# Altium schematic sheet bOOST cONVERTER_var 2.SchDoc
size A; SheetNumber: 3; SheetTotal: 4
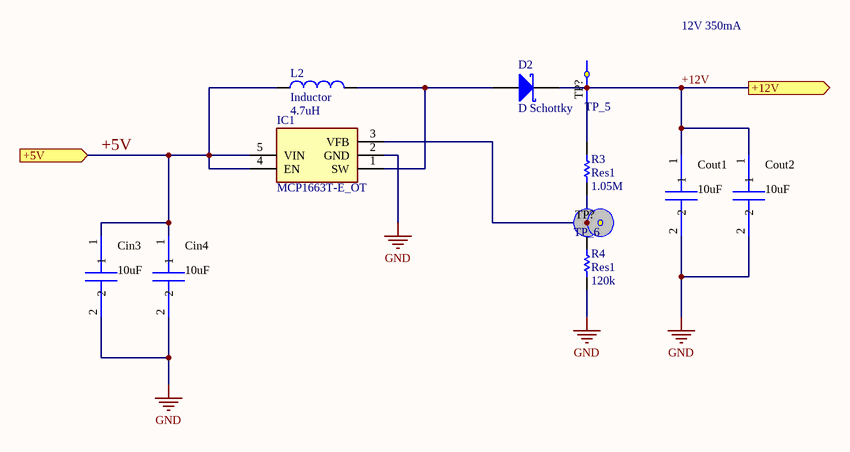
[diagram p0: bOOST cONVERTER_var 2.SchDoc]

## Parts
Cin3  value 10uF  (hidden comment: C3216X6S1V106K160AC)
Cin4  value 10uF  (hidden comment: C3216X6S1V106K160AC)
Cout1  value 10uF  (hidden comment: C3216X6S1V106K160AC)
Cout2  value 10uF  (hidden comment: C3216X6S1V106K160AC)
D2  D Schottky  [SMB]
IC1  MCP1663T-E_OT  [SOT95P270X145-5N]
L2  Inductor  value 4.7uH  [0402-A]
R3  Res1  value 1.05M  [AXIAL-0.3]
R4  Res1  value 120k  [AXIAL-0.3]
TP_5  Test_point  [PCBComponent_1]  (value not drawn)
TP_6  Test_point  [PCBComponent_1]  (value not drawn)

## Ports
+5V (in), +12V (out)

## Nets
GND: Cin3.2 Cin4.2 Cout1.2 Cout2.2 IC1.2(GND) R4.2
+5V: Cin3.1 Cin4.1 IC1.4(EN) IC1.5(VIN) L2.1 ; port +5V
+12V: Cout1.1 Cout2.1 D2.2(K) R3.1 TP_5.TP?(=value) ; port +12V
NetD2_1: D2.1(A) IC1.1(SW) L2.2
NetIC1_3: IC1.3(VFB) R3.2 R4.1 TP_6.TP?(=value)

## Notes on the sheet
- 12V 350mA

## Library data of the parts
Cin3 Cin4 Cout1 Cout2 = C3216X6S1V106K160AC: C3216X6S1V106K16; Manufacturer Name: TDK; PackageReference: C3216X6S1V106K160AC; Manufacturer Part Number: C3216X6S1V106K160AC
D2 = D Schottky: Schottky Diode; Published: 8-Jun-2000; LatestRevisionDate: 17-Jul-2002; LatestRevisionNote: Re-released for DXP Platform.; PackageReference: SMB; Publisher: Altium Limited; PackageDescription: DO-214-AA/SMB; 2 C-Bend Leads; Body 5.3 x 3.6 mm, inc. leads (LxW); Code_JEDEC: DO-214-AA
IC1 = MCP1663T-E_OT: Integrated Circuit; Manufacturer_Name: Microchip; Manufacturer_Part_Number: MCP1663T-E/OT; Datasheet Link: https://mouser.componentsearchengine.com/Datasheets/1/MCP1663T-E_OT.pdf; Height: 1.45mm; Mouser Part Number: 579-MCP1663T-E/OT; Mouser Price/Stock: https://www.mouser.co.uk/ProductDetail/Microchip-Technology-Atmel/MCP1663T-E-OT?qs=U5tD5cY1XDxnrZZotnnVrg%3D%3D; Arrow Part Number: MCP1663T-E/OT; Arrow Price/Stock: https://www.arrow.com/en/products/mcp1663t-eot/microchip-technology?region=nac
L2 = Inductor: Code_IEC: 1005; Published: 8-Jun-2000; LatestRevisionDate: 29-May-2009; LatestRevisionNote: IPC-7351 Footprint Added.; PackageReference: 0402-A; Publisher: Altium Limited; PackageDescription: Chip Inductor; Code_JEITA: 0402
R3 R4 = Res1: Resistor; Published: 8-Jun-2000; LatestRevisionDate: 17-Jul-2002; LatestRevisionNote: Re-released for DXP Platform.; PackageReference: AXIAL-0.3; Publisher: Altium Limited; PackageDescription: Axial Device, Thru-Hole; 2 Leads; 0.3 in Pin Spacing